# EAGLE design DoorOpenerPCBv2 (EAGLE 9.0.1)
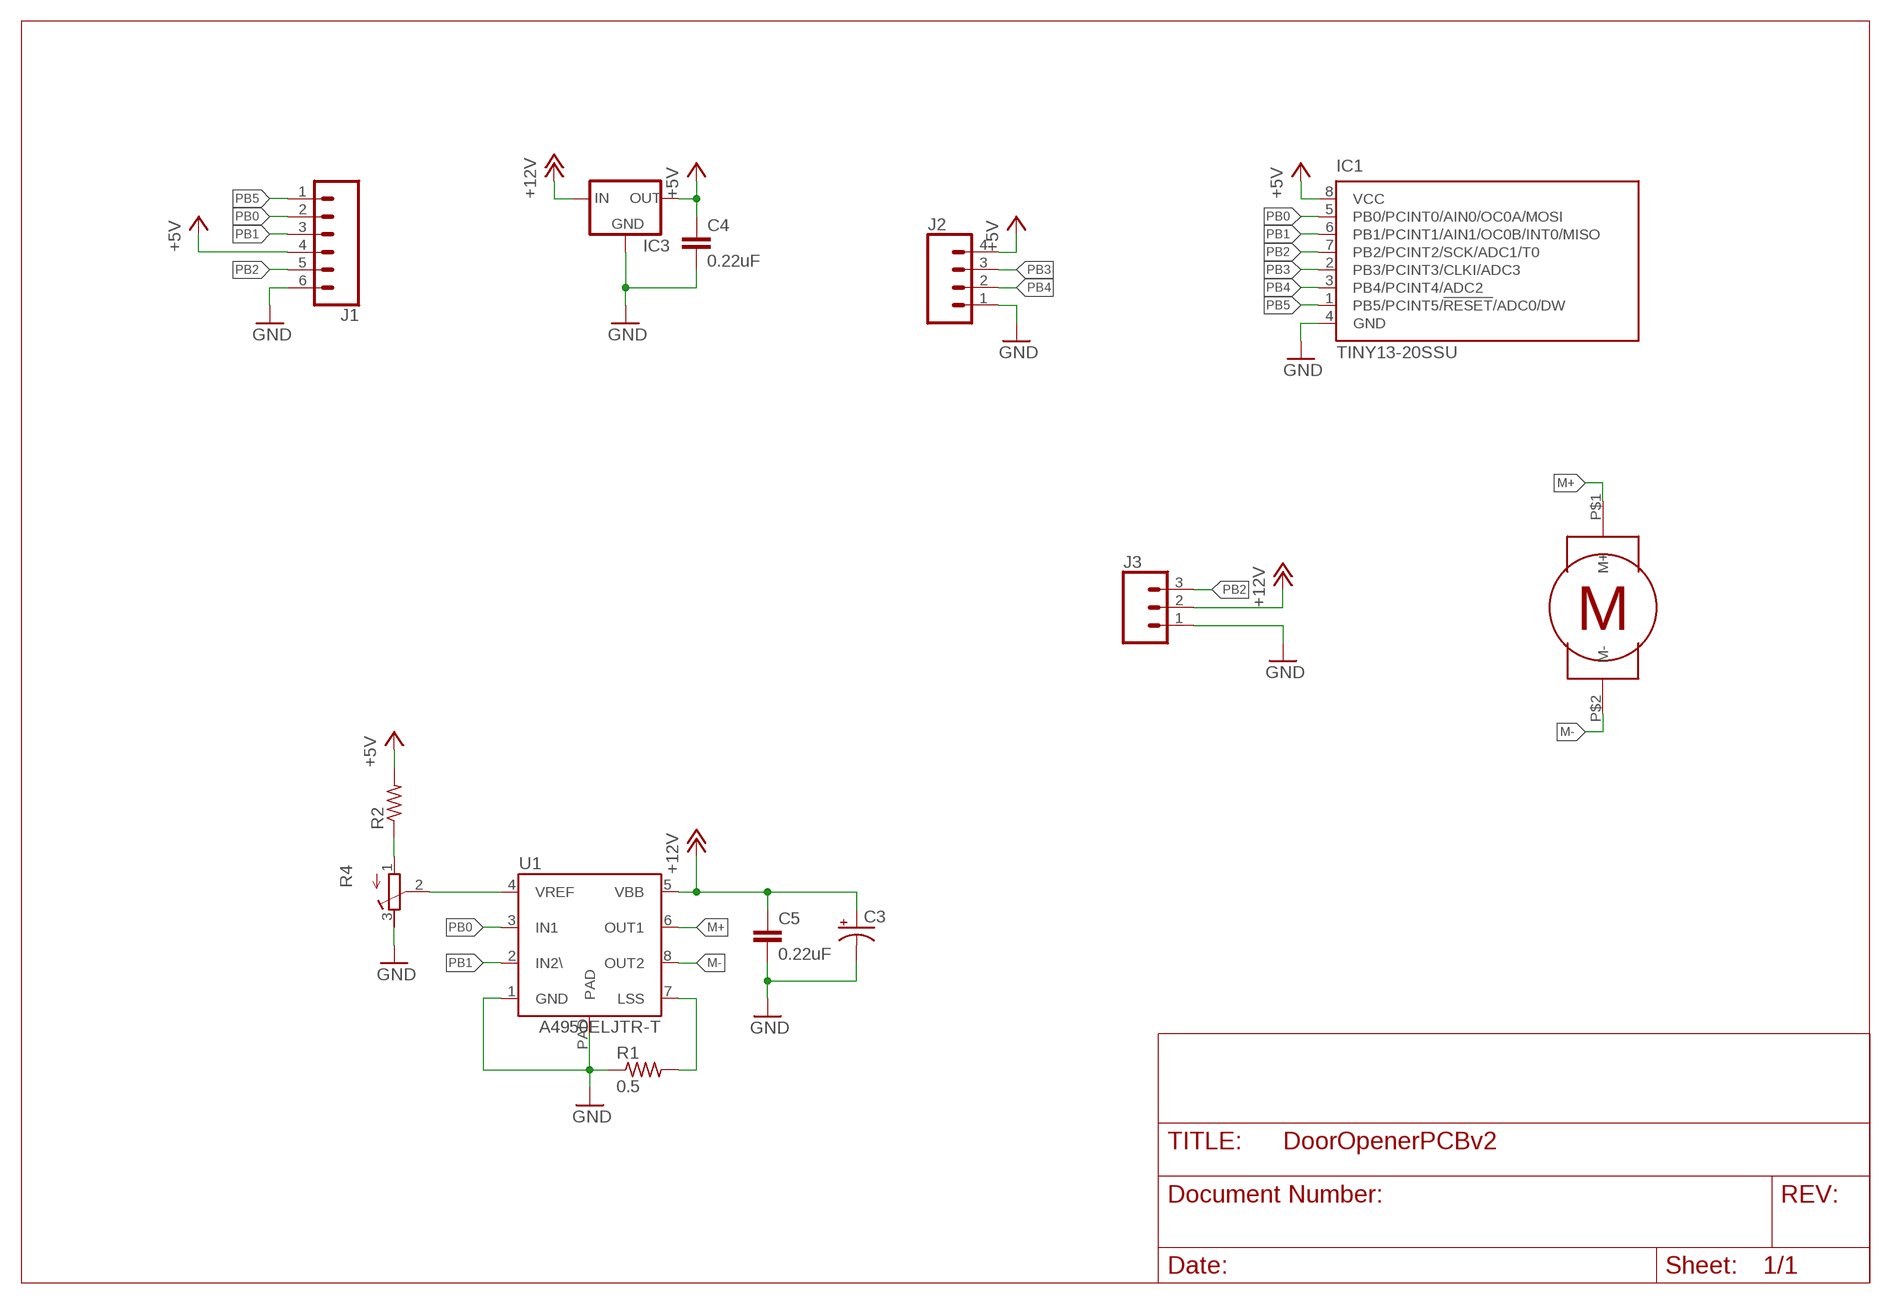
[diagram p0: schematic, sheet 1]

## Parts
C3  CPOL-USCT3528  [CT3528]
C4  0.22uF  C-EUC0603K  [C0603K]
C5  0.22uF  C-EUC0603K  [C0603K]
IC1  TINY13-20SSU  [8S1]
IC3  78LXX-SOT89R  [SOT89R]
J1  CONN_061.27MM  [1X06_1.27MM]
J2  CONN_041.27MM  [1X04_1.27MM]
J3  CONN_03JST-PTH-NS  [JST-3-PTH-NS]
R1  0.5  R-US_R0805  [R0805]
R2  R-US_R0603  [R0603]
R4  R-TRIMM3103  [RTRIM3103]
U1  A4950ELJTR-T  [SOIC8TP]
U$2  JGY-370  [PKG]

## Nets
+5V: C4.1 IC1.8(VCC) IC3.2(OUT) J1.4 J2.4 R2.2
+12V: C3.+ C5.1 IC3.1(IN) J3.2 U1.5(VBB)
GND: C3.- C4.2 C5.2 IC1.4(GND) IC3.3(GND) IC3.4(GND) J1.6 J2.1 J3.1 R1.1 R4.3(E) U1.1(GND) U1.PAD
M+: U1.6(OUT1) U$2.P$1(M+)
M-: U1.8(OUT2) U$2.P$2(M-)
N$1: R4.2(S) U1.4(VREF)
N$2: R1.2 U1.7(LSS)
N$3: R2.1 R4.1(A)
PB0: IC1.5(PB0/PCINT0/AIN0/OC0A/MOSI) J1.2 U1.3(IN1)
PB1: IC1.6(PB1/PCINT1/AIN1/OC0B/INT0/MISO) J1.3 U1.2(IN2\)
PB2: IC1.7(PB2/PCINT2/SCK/ADC1/T0) J1.5 J3.3
PB3: IC1.2(PB3/PCINT3/CLKI/ADC3) J2.3
PB4: IC1.3(PB4/PCINT4/ADC2) J2.2
PB5: IC1.1(PB5/PCINT5/!RESET!/ADC0/DW) J1.1

## Library data of the parts
C3 = rcl:CPOL-US: POLARIZED CAPACITOR, American symbol; SPICEPREFIX: C
C4 C5 = rcl:C-EU: CAPACITOR, European symbol; SPICEPREFIX: C
IC1 = atmel:TINY13: 8-bit AVR Microcontroller with 1K Bytes In-System Programmable Flash Source: http://www.atmel.com/dyn/resources/prod_documents/2535S.pdf; MPN: ATTINY13-20SSU; OC_FARNELL: 1455133; OC_NEWARK: 58M3771
IC3 = v-reg-3:78LXX: VOLTAGE REGULATOR
J1 = SparkFun-Connectors:CONN_06: Multi connection point. Often used as Generic Header-pin footprint for 0.1 inch spaced/style header connections On any of the 0.1 inch spaced packages, you can populate with these: Break Away Headers - Straight <https://www.sparkfun.com/products/116> (PRT-00116) Break Away Male Headers - Right Angle <https://www.sparkfun.com/products/553> (PRT-00553) Female Headers <https://www.sparkfun.com/products/115> (PRT-00115) Break Away Headers - Machine Pin <https://www.sparkfun.com/products/117> (PRT-00117) Break Away Female Headers - Swiss Machine Pin <https://www.sparkfun.com/products/743> (PRT-00743) Arduino Stackable Header - 6 Pin <https://www.sparkfun.com/products/9280> (PRT-09280) For SCREWTERMINALS and SPRING TERMINALS visit here: Screw Terimnals on SparkFun.com <https://www.sparkfun.com/search/results?term=Screw+Terminals> (5mm/3.5mm/2.54mm spacing) This device is also useful as a general connection point to wire up your design to another part of your project. Our various solder wires solder well into these plated through hole pads. Hook-Up Wire - Assortment (Stranded, 22 AWG) <https://www.sparkfun.com/products/11375> (PRT-11375) Hook-Up Wire - Assortment (Solid Core, 22 AWG) <https://www.sparkfun.com/products/11367> (PRT-11367) View the entire wire category on our website here <https://www.sparkfun.com/categories/141>
J2 = SparkFun-Connectors:CONN_04: Multi connection point. Often used as Generic Header-pin footprint for 0.1 inch spaced/style header connections On any of the 0.1 inch spaced packages, you can populate with these: Break Away Headers - Straight <https://www.sparkfun.com/products/116> (PRT-00116) Break Away Male Headers - Right Angle <https://www.sparkfun.com/products/553> (PRT-00553) Female Headers <https://www.sparkfun.com/products/115> (PRT-00115) Break Away Headers - Machine Pin <https://www.sparkfun.com/products/117> (PRT-00117) Break Away Female Headers - Swiss Machine Pin <https://www.sparkfun.com/products/743> (PRT-00743) For SCREWTERMINALS and SPRING TERMINALS visit here: Screw Terimnals on SparkFun.com <https://www.sparkfun.com/search/results?term=Screw+Terminals> (5mm/3.5mm/2.54mm spacing) This device is also useful as a general connection point to wire up your design to another part of your project. Our various solder wires solder well into these plated through hole pads. Hook-Up Wire - Assortment (Stranded, 22 AWG) <https://www.sparkfun.com/products/11375> (PRT-11375) Hook-Up Wire - Assortment (Solid Core, 22 AWG) <https://www.sparkfun.com/products/11367> (PRT-11367) View the entire wire category on our website here <https://www.sparkfun.com/categories/141> Special notes: Molex polarized connector foot print use with SKU : PRT-08231 with associated crimp pins and housings. 1MM SMD Version SKU: PRT-10208
J3 = SparkFun-Connectors:CONN_03: Multi connection point. Often used as Generic Header-pin footprint for 0.1 inch spaced/style header connections On any of the 0.1 inch spaced packages, you can populate with these: Break Away Headers - Straight <https://www.sparkfun.com/products/116> (PRT-00116) Break Away Male Headers - Right Angle <https://www.sparkfun.com/products/553> (PRT-00553) Female Headers <https://www.sparkfun.com/products/115> (PRT-00115) Break Away Headers - Machine Pin <https://www.sparkfun.com/products/117> (PRT-00117) Break Away Female Headers - Swiss Machine Pin <https://www.sparkfun.com/products/743> (PRT-00743) Stackable Header - 3 Pin (Female, 0.1") <https://www.sparkfun.com/products/13875> (PRT-13875) For SCREWTERMINALS and SPRING TERMINALS visit here: Screw Terimnals on SparkFun.com <https://www.sparkfun.com/search/results?term=Screw+Terminals> (5mm/3.5mm/2.54mm spacing) This device is also useful as a general connection point to wire up your design to another part of your project. Our various solder wires solder well into these plated through hole pads. Hook-Up Wire - Assortment (Stranded, 22 AWG) <https://www.sparkfun.com/products/11375> (PRT-11375) Hook-Up Wire - Assortment (Solid Core, 22 AWG) <https://www.sparkfun.com/products/11367> (PRT-11367) View the entire wire category on our website here <https://www.sparkfun.com/categories/141> Special notes: Molex polarized connector foot print use with SKU : PRT-08232 with associated crimp pins and housings.
R1 R2 = rcl:R-US_: RESISTOR, American symbol; SPICEPREFIX: R
R4 = rcl:R-TRIMM: Trimm resistor; SPICEMODEL: X; SPICEPREFIXL: POT
U1 = allegro:A4950ELJTR-T: IC MOTOR DRIVER PAR 8SOIC tested: YES (parallel gripper mcb)
U$2 = mot:JGY-370

## Board
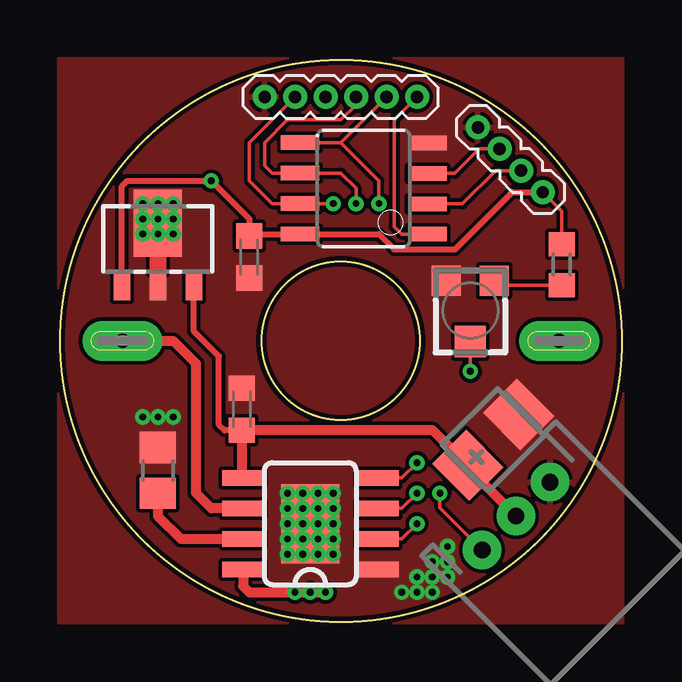
[diagram p1: board, top side]
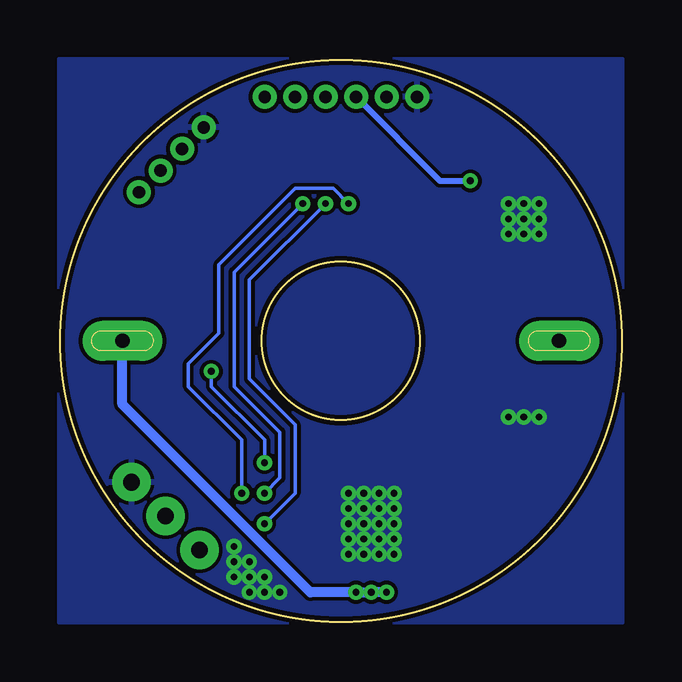
[diagram p2: board, bottom side, seen from below]

Size 23.4 x 23.4 mm. Coordinates in mm from the lower left corner, seen from the top.
Outline: circle at 11.7,11.7 radius 3.3
Outline: circle at 11.7,11.7 radius 11.7
Copper layers (1*16): Top 0.0356mm / dielectric 1.5011mm / Bottom 0.0356mm
Design rules "PCBs_io *": minimum track width 6mil, minimum drill 11mil, track to track 6mil, track to pad 6mil, pad to pad 6mil, via to via 6mil, smd to smd 6mil, copper to edge 7mil, drill to drill 6mil, minimum pad ring 7mil, minimum via ring 7mil, stop-mask expansion 3mil, vias tented up to drill 13mil, thermal gap 6mil

### Footprints (pad centres in the part's own frame; a part is rotated, then mirrored left to right if it is on the bottom)
CT3528 = smd 2 x 2.2: + -1.5,0; - 1.5,0
C0603K = smd 1.05 x 1.08: 1 -0.875,0; 2 0.875,0
8S1 = smd 0.6 x 1.6: 1 -1.905,-2.654; 2 -0.645,-2.654; 3 0.625,-2.654; 4 1.895,-2.654; 5 1.905,2.654; 6 0.635,2.654; 7 -0.635,2.654; 8 -1.905,2.654
SOT89R = smd 0.7 x 1.1: 1 1.5,-1.75; 2 -1.5,-1.75; 3 0,-1.75 | smd 2 x 2.8: 4 0,0.9
1X06_1.27MM = drill 0.508 pad 1: 1 0,0; 2 1.27,0; 3 2.54,0; 4 3.81,0; 5 5.08,0; 6 6.35,0
1X04_1.27MM = drill 0.508 pad 1: 1 0,0; 2 1.27,0; 3 2.54,0; 4 3.81,0
JST-3-PTH-NS = drill 0.7 pad 1.6: 1 -2,0; 2 0,0; 3 2,0
R0805 = smd 1.3 x 1.5: 1 -0.95,0; 2 0.95,0
R0603 = smd 1 x 1.1: 1 -0.85,0; 2 0.85,0
RTRIM3103 = smd 1.2 x 1.25: 1 -1,-1.225; 3 1,-1.225 | smd 1.3 x 1.3: 2 0,1.3
SOIC8TP = smd 1.75 x 0.65: 1 -2.8,1.905; 2 -2.8,0.635; 3 -2.8,-0.635; 4 -2.8,-1.905; 5 2.8,-1.905; 6 2.8,-0.635; 7 2.8,0.635; 8 2.8,1.905 | smd 2.41 x 3.3: PAD 0,0
PKG = drill 0.6 pad 1.676 long: P$1 -9.1,0; P$2 9.1,0

### Placement (x,y rotation side)
C3  18.05,7.57 45 top
C4  7.89,15.19 270 top
C5  7.57,8.84 90 top
IC1  12.65,18.05 90 top
IC3  4.08,15.7 0 top
J1  14.88,21.86 180 top
J2  17.41,20.59 315 top
J3  19,4.4 225 top
R1  4.08,6.3 270 top
R2  20.91,14.88 90 top
R4  17.1,12.97 180 top
U1  10.43,4.08 180 top
U$2  11.7,11.7 0 top

### Tracks (layer width: path | path; a pad name or v marks a point on that pad's centre or on a via)
+5V  (via drill 0.28)
  Top 0.152: J2.4 20.91,17.1 R2.2
  Top 0.254: IC1.8 10.11,16.14 | IC3.2 2.58,18.14 2.81,18.37 v6.3,18.37 7.89,16.78 C4.1 7.97,16.14 IC1.8 | J2.4 18.84,17.89 16.46,15.51 13.92,15.51 13.29,16.14 IC1.8
  Bottom 0.254: J1.4 7.57,18.37 v6.3,18.37
+12V
  Top 0.254: C5.1 6.86,7.97 6.62,8.21 6.62,11.06 5.58,12.1 IC3.1
  Top 0.406: J3.2 16.99,6.41 C3.+ 15.53,7.97 C5.1 7.57,6.04 U1.5
GND  (via drill 0.28)
  other vias: 4.08,17.41 11.38,2.81 11.38,3.44 11.38,4.08 11.38,4.71 11.38,5.35 4.71,8.52 4.08,8.52 3.44,8.52 4.71,17.41 3.44,17.41 3.44,16.78 4.08,16.78 4.71,16.78 4.71,16.14 3.44,16.14 4.08,16.14 16.14,1.86 15.51,1.86 15.51,1.22 14.88,1.22 16.14,2.49 15.51,2.49 16.14,3.13 14.88,1.86 14.24,1.22 10.75,2.81 10.75,3.44 10.75,4.08 10.75,4.71 10.75,5.35 10.11,2.81 10.11,3.44 10.11,4.08 10.11,4.71 10.11,5.35 9.48,2.81 9.48,3.44 9.48,4.08 9.48,4.71 9.48,5.35
  pour Bottom (no thermals): -0.05,-0.05 -0.05,23.45 7.57,23.45 7.57,20.91 9.16,20.91 9.16,23.45 16.46,23.45 16.46,19.64 17.41,19.64 19,21.23 19,23.45 23.45,23.45 23.45,7.25 19.64,7.25 19,6.62 19,5.67 20.59,4.08 23.45,4.08 23.45,-0.05
  pour Top (no thermals): 23.45,4.08 23.45,-0.05 -0.05,-0.05 -0.05,23.45 7.57,23.45 7.57,20.91 9.16,20.91 9.16,23.45 16.46,23.45 16.46,19.64 17.41,19.64 19,21.23 19,23.45 23.45,23.45 23.45,7.25 19.64,7.25 19,6.62 19,5.67 20.59,4.08
  pour Top: 20.59,4.08 23.45,4.08 23.45,7.25 19.64,7.25 19,6.62 19,5.67
  pour Bottom: 20.59,4.08 19,5.67 19,6.62 19.64,7.25 23.45,7.25 23.45,4.08
  pour Bottom: 7.57,20.91 9.16,20.91 9.16,23.45 7.57,23.45
  pour Top: 7.57,20.91 9.16,20.91 9.16,23.45 7.57,23.45
  pour Top: 19,21.23 17.41,19.64 16.46,19.64 16.46,23.45 19,23.45
  pour Bottom: 17.41,19.64 19,21.23 19,23.45 16.46,23.45 16.46,19.64
M+
  Top 0.406: U1.6 6.3,4.71 5.67,5.35 5.67,10.75 4.71,11.7 U$2.P$1
M-  (via drill 0.28)
  Top 0.406: U1.8 7.63,1.48 7.89,1.22 v9.79,1.22 v10.43,1.22 v11.06,1.22
  Bottom 0.406: v9.79,1.22 v10.43,1.22 v11.06,1.22 12.97,1.22 20.8,9.05 U$2.P$2
N$1  (via drill 0.28)
  Top 0.152: v17.1,10.43 R4.2 | U1.4 14.24,5.98 v14.88,6.62
  Bottom 0.152: v17.1,10.43 17.1,9.79 14.88,7.57 v14.88,6.62
N$2
  Top 0.406: R1.2 4.08,4.4 5.03,3.44 U1.7
N$3
  Top 0.152: R2.1 18.27,14.02 R4.1
PB0  (via drill 0.28)
  Top 0.152: J1.2 11.7,19.95 | IC1.5 11.7,19.95 | v13.29,17.41 13.29,18.37 11.7,19.95 | U1.3 14.24,4.71 v14.88,5.35
  Bottom 0.152: v13.29,17.41 16.14,14.56 16.14,9.79 14.24,7.89 14.24,5.98 v14.88,5.35
PB1  (via drill 0.28)
  Top 0.152: J1.3 12.33,21.54 11.7,20.91 9.48,20.91 8.52,19.95 8.52,19 8.84,18.68 IC1.6 11.7,18.68 12.33,18.05 v12.33,17.41 | U1.2 14.24,3.44 v14.88,4.08
  Bottom 0.152: v12.33,17.41 15.51,14.24 15.51,10.11 13.6,8.21 13.6,5.35 v14.88,4.08
PB2  (via drill 0.28)
  Top 0.152: J1.5 7.89,19.95 7.89,18.37 8.84,17.41 IC1.7 v11.38,17.41 | 17.56,2.98 J3.3 15.83,4.74 v15.83,5.35
  Bottom 0.152: v15.83,5.35 15.83,7.57 18.05,9.79 18.05,10.75 16.78,12.02 16.78,14.88 13.6,18.05 12.02,18.05 v11.38,17.41
PB3
  Top 0.152: J2.3 18.16,18.79 16.77,17.41 IC1.2
PB4
  Top 0.152: J2.2 17.47,19.69 16.45,18.67 IC1.3
PB5
  Top 0.152: J1.1 13.92,20.91 13.92,16.46 14.24,16.14 IC1.1